# Altium project HW_Dron_V2.PrjPcb
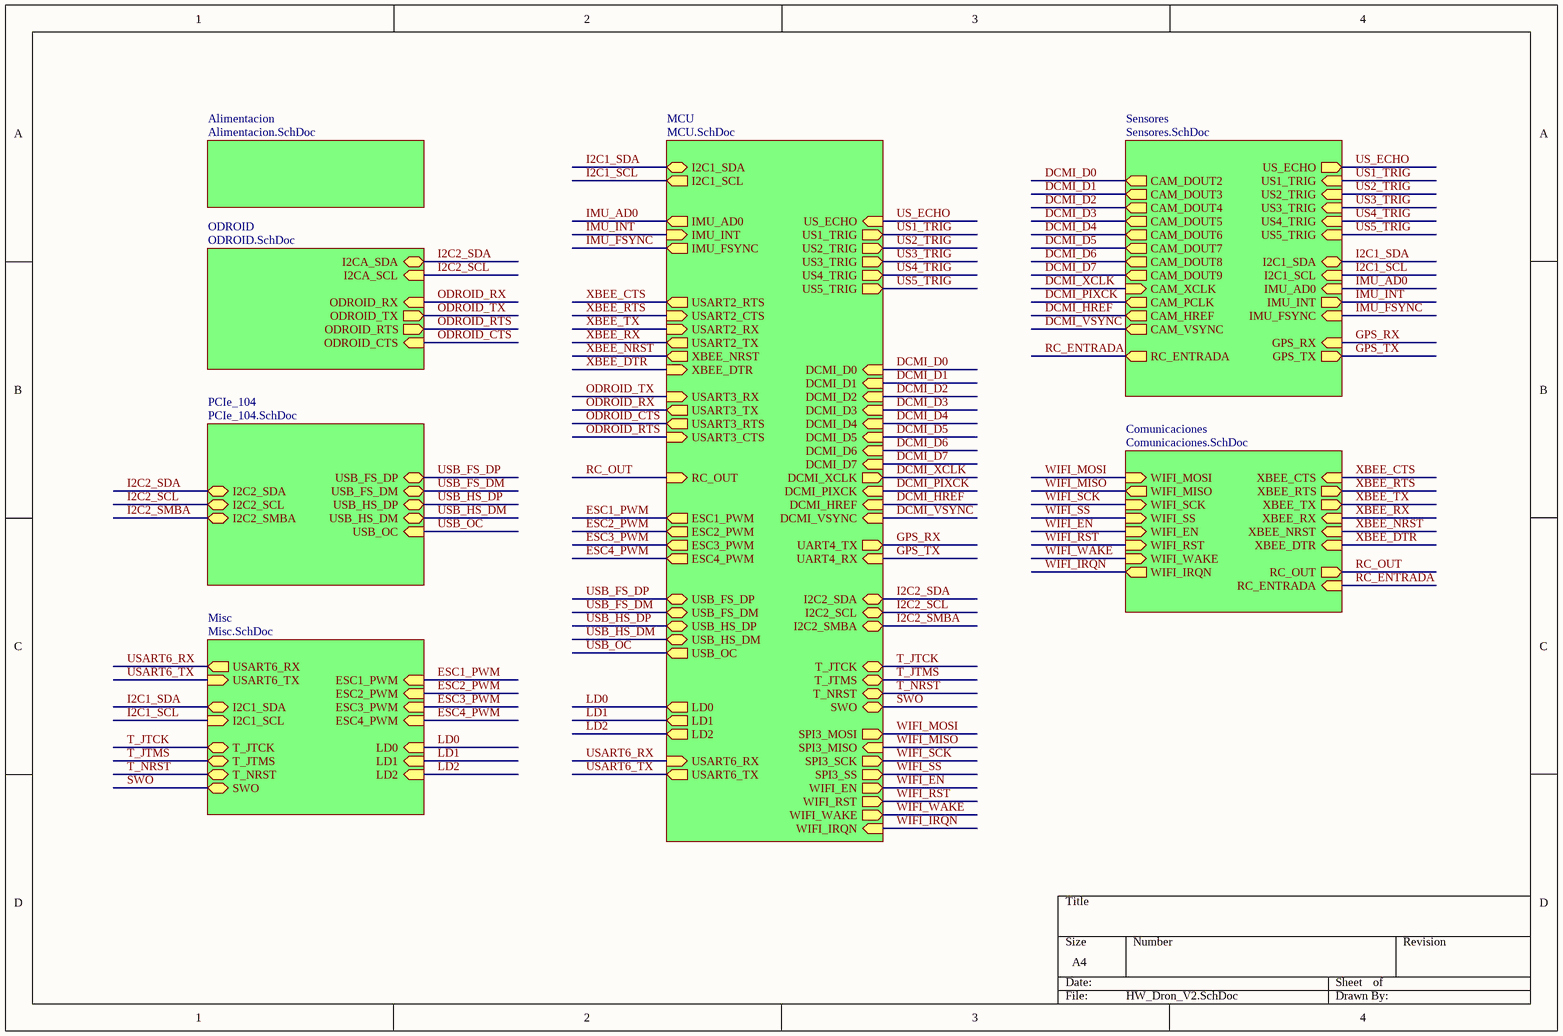
[diagram p0: HW_Dron_V2.SchDoc]
8 sheets, 111 parts. Net scope: hierarchical (ports join the sheet entries above them; power ports are global).
Board file: HW_Dron_V2.PcbDoc
Sheets:
  HW_Dron_V2.SchDoc
    MCU = MCU.SchDoc
    Sensores = Sensores.SchDoc
    Alimentacion = Alimentacion.SchDoc
    Comunicaciones = Comunicaciones.SchDoc
    ODROID = ODROID.SchDoc
    PCIe_104 = PCIe_104.SchDoc
    Misc = Misc.SchDoc

## Sheet HW_Dron_V2.SchDoc
size A4

### Sub-sheets
Alimentacion = Alimentacion.SchDoc: no entries
Comunicaciones = Comunicaciones.SchDoc: XBEE_TX (out), XBEE_RX (in), XBEE_NRST (in), XBEE_CTS (in), XBEE_RTS (out), RC_OUT (out), WIFI_MOSI (in), WIFI_MISO (out), WIFI_SCK (in), WIFI_SS (in), WIFI_EN (in), WIFI_RST (in), WIFI_WAKE (in), WIFI_IRQN (out), XBEE_DTR (in), RC_ENTRADA (in)
MCU = MCU.SchDoc: I2C1_SDA (bidir), I2C1_SCL (out), IMU_AD0 (out), IMU_INT (in), US_ECHO (in), US1_TRIG (out), US2_TRIG (out), US3_TRIG (out), US4_TRIG (out), US5_TRIG (out), DCMI_D0 (in), DCMI_D1 (in), DCMI_D2 (in), DCMI_D3 (in), DCMI_D4 (in), DCMI_D5 (in), DCMI_D6 (in), DCMI_D7 (in), DCMI_PIXCK (in), DCMI_HREF (in), DCMI_VSYNC (in), DCMI_XCLK (out), USART2_RX (in), USART2_TX (out), XBEE_NRST (out), USART2_RTS (out), USART2_CTS (in), RC_OUT (in), UART4_TX (out), UART4_RX (in), ESC1_PWM (out), ESC2_PWM (out), ESC3_PWM (out), ESC4_PWM (out), I2C2_SDA (bidir), I2C2_SCL (bidir), I2C2_SMBA (bidir), USB_HS_DP (bidir), USB_HS_DM (bidir), USB_OC (out), T_JTCK, T_JTMS, T_NRST, LD0 (out), LD1 (out), LD2 (out), SPI3_MOSI (out), SPI3_MISO (in), SPI3_SCK (out), SPI3_SS (out), WIFI_EN (out), WIFI_RST (out), WIFI_WAKE (out), WIFI_IRQN (in), USB_FS_DP (bidir), USB_FS_DM (bidir), USART6_RX (in), USART6_TX (out), IMU_FSYNC (out), XBEE_DTR (in), USART3_TX (out), USART3_RX (in), USART3_CTS (in), USART3_RTS (out), SWO
Misc = Misc.SchDoc: ESC1_PWM (in), ESC2_PWM (in), ESC3_PWM (in), ESC4_PWM (in), USART6_RX (out), USART6_TX (in), I2C1_SDA (bidir), I2C1_SCL (in), LD0 (in), LD1 (in), LD2 (in), T_JTCK, T_JTMS, T_NRST, SWO
ODROID = ODROID.SchDoc: ODROID_RX (in), ODROID_TX (out), ODROID_RTS (out), ODROID_CTS (in), I2CA_SDA (bidir), I2CA_SCL (in)
PCIe_104 = PCIe_104.SchDoc: USB_HS_DP (bidir), USB_HS_DM (bidir), USB_OC (in), USB_FS_DP (bidir), USB_FS_DM (bidir), I2C2_SDA (bidir), I2C2_SCL (bidir), I2C2_SMBA (bidir)
Sensores = Sensores.SchDoc: I2C1_SCL (in), I2C1_SDA (bidir), IMU_AD0 (in), IMU_INT (out), US_ECHO (out), US1_TRIG (in), US2_TRIG (in), US3_TRIG (in), US4_TRIG (in), US5_TRIG (in), GPS_RX (in), GPS_TX (out), CAM_PCLK (out), CAM_HREF (out), CAM_VSYNC (out), CAM_XCLK (in), CAM_DOUT2 (out), CAM_DOUT3 (out), CAM_DOUT4 (out), CAM_DOUT5 (out), CAM_DOUT6 (out), CAM_DOUT7 (out), CAM_DOUT8 (out), CAM_DOUT9 (out), IMU_FSYNC (in), RC_ENTRADA (out)

### Nets
DCMI_D0: sheet MCU/DCMI_D0, sheet Sensores/CAM_DOUT2
DCMI_D1: sheet MCU/DCMI_D1, sheet Sensores/CAM_DOUT3
DCMI_D2: sheet MCU/DCMI_D2, sheet Sensores/CAM_DOUT4
DCMI_D3: sheet MCU/DCMI_D3, sheet Sensores/CAM_DOUT5
DCMI_D4: sheet MCU/DCMI_D4, sheet Sensores/CAM_DOUT6
DCMI_D5: sheet MCU/DCMI_D5, sheet Sensores/CAM_DOUT7
DCMI_D6: sheet MCU/DCMI_D6, sheet Sensores/CAM_DOUT8
DCMI_D7: sheet MCU/DCMI_D7, sheet Sensores/CAM_DOUT9
DCMI_HREF: sheet MCU/DCMI_HREF, sheet Sensores/CAM_HREF
DCMI_PIXCK: sheet MCU/DCMI_PIXCK, sheet Sensores/CAM_PCLK
DCMI_VSYNC: sheet MCU/DCMI_VSYNC, sheet Sensores/CAM_VSYNC
DCMI_XCLK: sheet MCU/DCMI_XCLK, sheet Sensores/CAM_XCLK
ESC1_PWM: sheet MCU/ESC1_PWM, sheet Misc/ESC1_PWM
ESC2_PWM: sheet MCU/ESC2_PWM, sheet Misc/ESC2_PWM
ESC3_PWM: sheet MCU/ESC3_PWM, sheet Misc/ESC3_PWM
ESC4_PWM: sheet MCU/ESC4_PWM, sheet Misc/ESC4_PWM
GPS_RX: sheet MCU/UART4_TX, sheet Sensores/GPS_RX
GPS_TX: sheet MCU/UART4_RX, sheet Sensores/GPS_TX
I2C1_SCL: sheet MCU/I2C1_SCL, sheet Sensores/I2C1_SCL, sheet Misc/I2C1_SCL
I2C1_SDA: sheet MCU/I2C1_SDA, sheet Sensores/I2C1_SDA, sheet Misc/I2C1_SDA
I2C2_SCL: sheet MCU/I2C2_SCL, sheet ODROID/I2CA_SCL, sheet PCIe_104/I2C2_SCL
I2C2_SDA: sheet MCU/I2C2_SDA, sheet ODROID/I2CA_SDA, sheet PCIe_104/I2C2_SDA
I2C2_SMBA: sheet MCU/I2C2_SMBA, sheet PCIe_104/I2C2_SMBA
IMU_AD0: sheet MCU/IMU_AD0, sheet Sensores/IMU_AD0
IMU_FSYNC: sheet MCU/IMU_FSYNC, sheet Sensores/IMU_FSYNC
IMU_INT: sheet MCU/IMU_INT, sheet Sensores/IMU_INT
LD0: sheet MCU/LD0, sheet Misc/LD0
LD1: sheet MCU/LD1, sheet Misc/LD1
LD2: sheet MCU/LD2, sheet Misc/LD2
ODROID_CTS: sheet MCU/USART3_RTS, sheet ODROID/ODROID_CTS
ODROID_RTS: sheet MCU/USART3_CTS, sheet ODROID/ODROID_RTS
ODROID_RX: sheet MCU/USART3_TX, sheet ODROID/ODROID_RX
ODROID_TX: sheet MCU/USART3_RX, sheet ODROID/ODROID_TX
RC_ENTRADA: sheet Sensores/RC_ENTRADA, sheet Comunicaciones/RC_ENTRADA
RC_OUT: sheet MCU/RC_OUT, sheet Comunicaciones/RC_OUT
SWO: sheet MCU/SWO, sheet Misc/SWO
T_JTCK: sheet MCU/T_JTCK, sheet Misc/T_JTCK
T_JTMS: sheet MCU/T_JTMS, sheet Misc/T_JTMS
T_NRST: sheet MCU/T_NRST, sheet Misc/T_NRST
US1_TRIG: sheet MCU/US1_TRIG, sheet Sensores/US1_TRIG
US2_TRIG: sheet MCU/US2_TRIG, sheet Sensores/US2_TRIG
US3_TRIG: sheet MCU/US3_TRIG, sheet Sensores/US3_TRIG
US4_TRIG: sheet MCU/US4_TRIG, sheet Sensores/US4_TRIG
US5_TRIG: sheet MCU/US5_TRIG, sheet Sensores/US5_TRIG
US_ECHO: sheet MCU/US_ECHO, sheet Sensores/US_ECHO
USART6_RX: sheet MCU/USART6_RX, sheet Misc/USART6_RX
USART6_TX: sheet MCU/USART6_TX, sheet Misc/USART6_TX
USB_FS_DM: sheet MCU/USB_FS_DM, sheet PCIe_104/USB_FS_DM  [project net USB0_N]
USB_FS_DP: sheet MCU/USB_FS_DP, sheet PCIe_104/USB_FS_DP  [project net USB0_P]
USB_HS_DM: sheet MCU/USB_HS_DM, sheet PCIe_104/USB_HS_DM  [project net USB1_N]
USB_HS_DP: sheet MCU/USB_HS_DP, sheet PCIe_104/USB_HS_DP  [project net USB1_P]
USB_OC: sheet MCU/USB_OC, sheet PCIe_104/USB_OC
WIFI_EN: sheet MCU/WIFI_EN, sheet Comunicaciones/WIFI_EN
WIFI_IRQN: sheet MCU/WIFI_IRQN, sheet Comunicaciones/WIFI_IRQN
WIFI_MISO: sheet MCU/SPI3_MISO, sheet Comunicaciones/WIFI_MISO
WIFI_MOSI: sheet MCU/SPI3_MOSI, sheet Comunicaciones/WIFI_MOSI
WIFI_RST: sheet MCU/WIFI_RST, sheet Comunicaciones/WIFI_RST
WIFI_SCK: sheet MCU/SPI3_SCK, sheet Comunicaciones/WIFI_SCK
WIFI_SS: sheet MCU/SPI3_SS, sheet Comunicaciones/WIFI_SS
WIFI_WAKE: sheet MCU/WIFI_WAKE, sheet Comunicaciones/WIFI_WAKE
XBEE_CTS: sheet MCU/USART2_RTS, sheet Comunicaciones/XBEE_CTS
XBEE_DTR: sheet MCU/XBEE_DTR, sheet Comunicaciones/XBEE_DTR
XBEE_NRST: sheet MCU/XBEE_NRST, sheet Comunicaciones/XBEE_NRST
XBEE_RTS: sheet MCU/USART2_CTS, sheet Comunicaciones/XBEE_RTS
XBEE_RX: sheet MCU/USART2_TX, sheet Comunicaciones/XBEE_RX
XBEE_TX: sheet MCU/USART2_RX, sheet Comunicaciones/XBEE_TX

## Sheet MCU.SchDoc
size A4
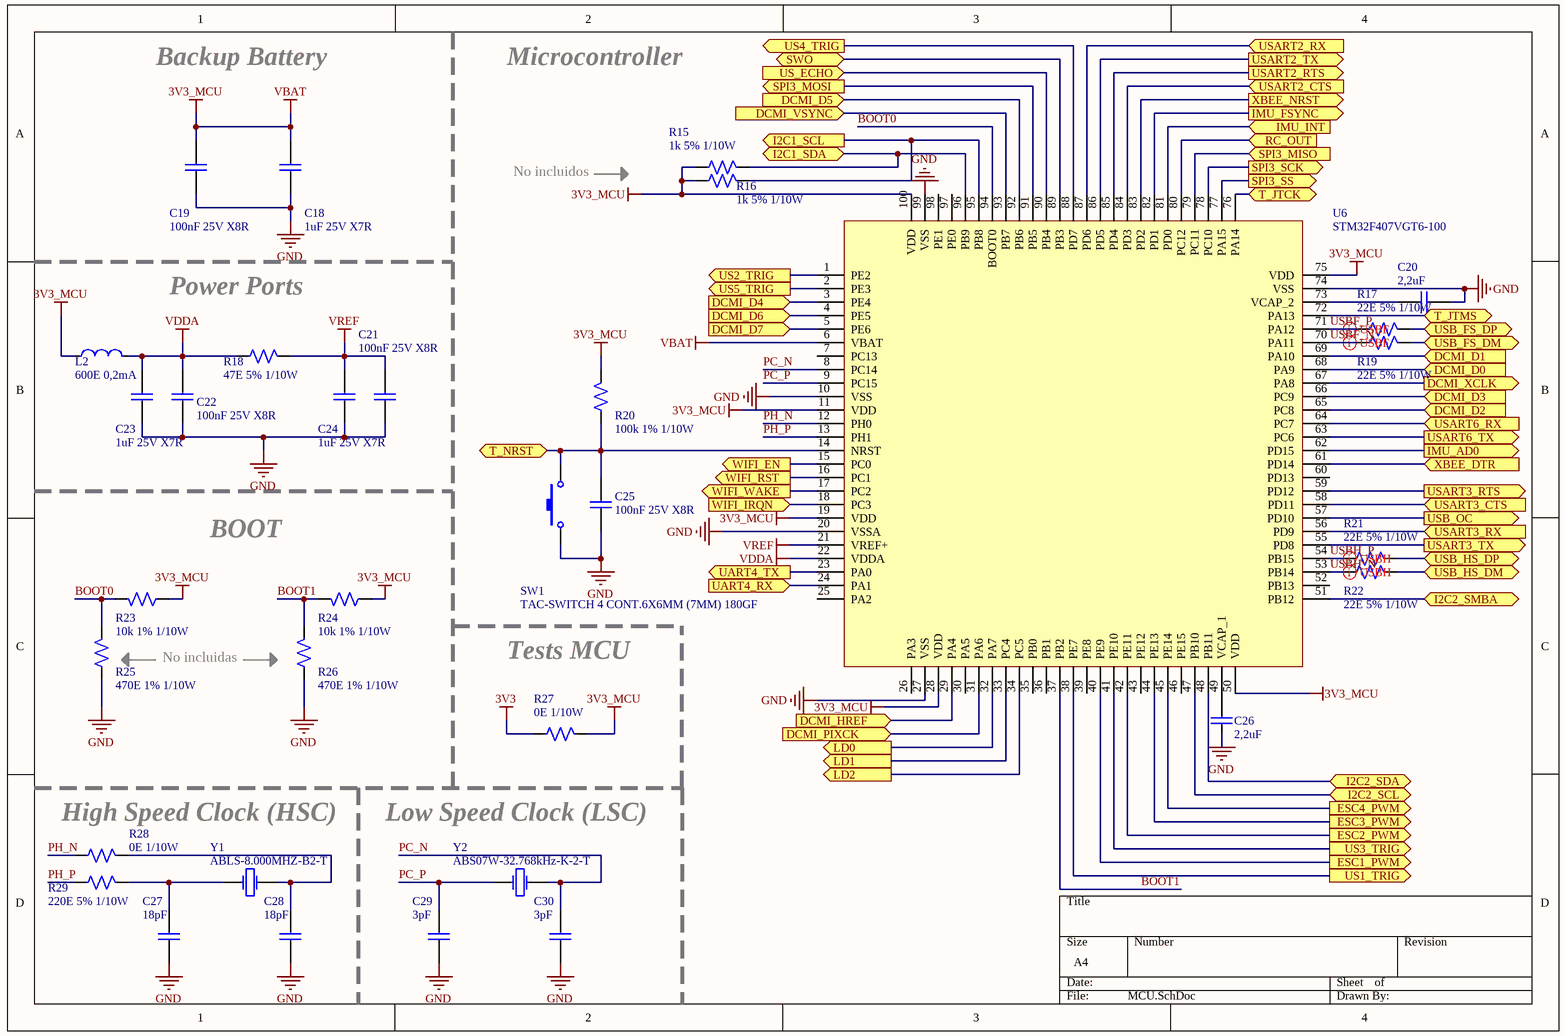
[diagram p1: MCU.SchDoc]

### Parts
C18  1uF 25V X7R  [C0603]
C19  100nF 25V X8R  [C0603]
C20  Valor: 2,2uF  [C0603]  (hidden comment: 2,2uF 16V X7R)
C21  100nF 25V X8R  [C0603]
C22  100nF 25V X8R  [C0603]
C23  1uF 25V X7R  [C0603]
C24  1uF 25V X7R  [C0603]
C25  100nF 25V X8R  [C0603]
C26  Valor: 2,2uF  [C0603]  (hidden comment: 2,2uF 16V X7R)
C27  Valor: 18pF  [C0603]  (hidden comment: 18pF 50V COG 5%)
C28  Valor: 18pF  [C0603]  (hidden comment: 18pF 50V COG 5%)
C29  Valor: 3pF  [C0603]  (hidden comment: 3pF 50V COG 5%)
C30  Valor: 3pF  [C0603]  (hidden comment: 3pF 50V COG 5%)
L2  600E 0,2mA  [L0805]
R15  1k 5% 1/10W  [R0603]
R16  1k 5% 1/10W  [R0603]
R17  22E 5% 1/10W  [R0603]
R18  47E 5% 1/10W  [R0603]
R19  22E 5% 1/10W  [R0603]
R20  100k 1% 1/10W  [R0603]
R21  22E 5% 1/10W  [R0603]
R22  22E 5% 1/10W  [R0603]
R23  10k 1% 1/10W  [R0603]
R24  10k 1% 1/10W  [R0603]
R25  470E 1% 1/10W  [R0603]
R26  470E 1% 1/10W  [R0603]
R27  0E 1/10W  [R0805]
R28  0E 1/10W  [R0603]
R29  220E 5% 1/10W  [R0603]
SW1  TAC-SWITCH 4 CONT.6X6MM (7MM) 180GF  [TAC_SW_4]
U6  STM32F407VGT6-100  [QFP100]
Y1  ABLS-8.000MHZ-B2-T  [ABLS]
Y2  ABS07W-32.768kHz-K-2-T  [ABS07W]

### Ports
DCMI_D0 (in), DCMI_D1 (in), DCMI_D2 (in), DCMI_D3 (in), DCMI_D4 (in), DCMI_D5 (in), DCMI_D6 (in), DCMI_D7 (in), DCMI_HREF (in), DCMI_PIXCK (in), DCMI_VSYNC (in), DCMI_XCLK (out), ESC1_PWM (out), ESC2_PWM (out), ESC3_PWM (out), ESC4_PWM (out), I2C1_SCL (out), I2C1_SDA (bidir), I2C2_SCL (bidir), I2C2_SDA (bidir), I2C2_SMBA (bidir), IMU_AD0 (out), IMU_FSYNC (out), IMU_INT (in), LD0 (out), LD1 (out), LD2 (out), RC_OUT (in), SPI3_MISO (in), SPI3_MOSI (out), SPI3_SCK (out), SPI3_SS (out), SWO, T_JTCK, T_JTMS, T_NRST, UART4_RX (in), UART4_TX (out), US1_TRIG (out), US2_TRIG (out), US3_TRIG (out), US4_TRIG (out), US5_TRIG (out), US_ECHO (in), USART2_CTS (in), USART2_RTS (out), USART2_RX (in), USART2_TX (out), USART3_CTS (in), USART3_RTS (out), USART3_RX (in), USART3_TX (out), USART6_RX (in), USART6_TX (out), USB_FS_DM (bidir), USB_FS_DP (bidir), USB_HS_DM (bidir), USB_HS_DP (bidir), USB_OC (out), WIFI_EN (out), WIFI_IRQN (in), WIFI_RST (out), WIFI_WAKE (out), XBEE_DTR (in), XBEE_NRST (out)

### Nets
3V3: R27.1
3V3_MCU: C18.1 C19.1 L2.1 R15.1 R16.1 R20.2 R23.1 R24.1 R27.2 U6.6(VBAT) U6.11(VDD) U6.19(VDD) U6.28(VDD) U6.50(VDD) U6.75(VDD) U6.100(VDD)  [also labelled VBAT]
GND: C18.2 C19.2 C20.2 C21.2 C22.2 C23.2 C24.2 C25.2 C26.2 C27.2 C28.2 C29.2 C30.2 R25.1 R26.1 SW1.1 U6.10(VSS) U6.20(VSSA) U6.27(VSS) U6.74(VSS) U6.99(VSS)
VDDA: C22.1 C23.1 L2.2 R18.1 U6.22(VDDA)
VREF: C21.1 C24.1 R18.2 U6.21(VREF+)
BOOT0: R23.2 R25.2 U6.94(BOOT0)
BOOT1: R24.2 R26.2 U6.37(PB2)
DCMI_D0: U6.68(PA9) ; port DCMI_D0
DCMI_D1: U6.69(PA10) ; port DCMI_D1
DCMI_D2: U6.65(PC8) ; port DCMI_D2
DCMI_D3: U6.66(PC9) ; port DCMI_D3
DCMI_D4: U6.3(PE4) ; port DCMI_D4
DCMI_D5: U6.92(PB6) ; port DCMI_D5
DCMI_D6: U6.4(PE5) ; port DCMI_D6
DCMI_D7: U6.5(PE6) ; port DCMI_D7
DCMI_HREF: U6.29(PA4) ; port DCMI_HREF
DCMI_PIXCK: U6.31(PA6) ; port DCMI_PIXCK
DCMI_VSYNC: U6.93(PB7) ; port DCMI_VSYNC
DCMI_XCLK: U6.67(PA8) ; port DCMI_XCLK
ESC1_PWM: U6.40(PE9) ; port ESC1_PWM
ESC2_PWM: U6.42(PE11) ; port ESC2_PWM
ESC3_PWM: U6.44(PE13) ; port ESC3_PWM
ESC4_PWM: U6.45(PE14) ; port ESC4_PWM
GPS_RX: U6.23(PA0) ; port UART4_TX
GPS_TX: U6.24(PA1) ; port UART4_RX
I2C1_SCL: R16.2 U6.95(PB8) ; port I2C1_SCL
I2C1_SDA: R15.2 U6.96(PB9) ; port I2C1_SDA
I2C2_SCL: U6.47(PB10) ; port I2C2_SCL
I2C2_SDA: U6.48(PB11) ; port I2C2_SDA
I2C2_SMBA: U6.51(PB12) ; port I2C2_SMBA
IMU_AD0: U6.62(PD15) ; port IMU_AD0
IMU_FSYNC: U6.82(PD1) ; port IMU_FSYNC
IMU_INT: U6.81(PD0) ; port IMU_INT
LD0: U6.32(PA7) ; port LD0
LD1: U6.33(PC4) ; port LD1
LD2: U6.34(PC5) ; port LD2
ODROID_CTS: U6.59(PD12) ; port USART3_RTS
ODROID_RTS: U6.58(PD11) ; port USART3_CTS
ODROID_RX: U6.55(PD8) ; port USART3_TX
ODROID_TX: U6.56(PD9) ; port USART3_RX
PC_N: C30.1 U6.8(PC14) Y2.2
PC_P: C29.1 U6.9(PC15) Y2.1
PH_N: R28.1 U6.12(PH0)
PH_P: R29.1 U6.13(PH1)
RC_OUT: U6.80(PC12) ; port RC_OUT
SWO: U6.89(PB3) ; port SWO
T_JTCK: U6.76(PA14) ; port T_JTCK
T_JTMS: U6.72(PA13) ; port T_JTMS
T_NRST: C25.1 R20.1 SW1.2 U6.14(NRST) ; port T_NRST
US1_TRIG: U6.38(PE7) ; port US1_TRIG
US2_TRIG: U6.1(PE2) ; port US2_TRIG
US3_TRIG: U6.41(PE10) ; port US3_TRIG
US4_TRIG: U6.88(PD7) ; port US4_TRIG
US5_TRIG: U6.2(PE3) ; port US5_TRIG
US_ECHO: U6.90(PB4) ; port US_ECHO
USART6_RX: U6.64(PC7) ; port USART6_RX
USART6_TX: U6.63(PC6) ; port USART6_TX
USB0_N: R19.2 ; port USB_FS_DM
USB0_P: R17.2 ; port USB_FS_DP
USB1_N: R22.2 ; port USB_HS_DM
USB1_P: R21.2 ; port USB_HS_DP
USB_OC: U6.57(PD10) ; port USB_OC
USBF_N: R19.1 U6.70(PA11)
USBF_P: R17.1 U6.71(PA12)
USBH_N: R22.1 U6.53(PB14)
USBH_P: R21.1 U6.54(PB15)
WIFI_EN: U6.15(PC0) ; port WIFI_EN
WIFI_IRQN: U6.18(PC3) ; port WIFI_IRQN
WIFI_MISO: U6.79(PC11) ; port SPI3_MISO
WIFI_MOSI: U6.91(PB5) ; port SPI3_MOSI
WIFI_RST: U6.16(PC1) ; port WIFI_RST
WIFI_SCK: U6.78(PC10) ; port SPI3_SCK
WIFI_SS: U6.77(PA15) ; port SPI3_SS
WIFI_WAKE: U6.17(PC2) ; port WIFI_WAKE
XBEE_CTS: U6.85(PD4) ; port USART2_RTS
XBEE_DTR: U6.61(PD14) ; port XBEE_DTR
XBEE_NRST: U6.83(PD2) ; port XBEE_NRST
XBEE_RTS: U6.84(PD3) ; port USART2_CTS
XBEE_RX: U6.86(PD5) ; port USART2_TX
XBEE_TX: U6.87(PD6) ; port USART2_RX
NetC20_1: C20.1 U6.73(VCAP_2)
NetC26_1: C26.1 U6.49(VCAP_1)
NetC27_1: C27.1 R29.2 Y1.1
NetC28_1: C28.1 R28.2 Y1.2

Not connected (* = marked no-connect by the designer): U6 7(PC13) 25(PA2) 26(PA3) 30(PA5) 35(PB0) 36(PB1) 39(PE8) 43(PE12) 46(PE15) 52(PB13) 60(PD13) 97(PE0) 98(PE1)

### Layout directives
differential pair: USBF_N, USBF_P, USBH_N, USBH_P

### Notes on the sheet
- Backup Battery
- Microcontroller
- No incluidos
- Power Ports
- BOOT
- No incluidas
- Tests MCU
- (near R28) High Speed Clock (HSC)
- Low Speed Clock (LSC)

### Library data of the parts
C18 C23 C24 = Capacitor: Capacitor de placas paralelas; Proveedor: Mouser; Cod. Proveedor: 810-C1608X7R1E105KAE; Encapsulado: C0603; Valor: 1uF; Link: https://ar.mouser.com
C19 C21 C22 C25 = Capacitor: Capacitor de placas paralelas; Proveedor: Mouser; Cod. Proveedor: 810-C1608X8R1E104K; Encapsulado: C0603; Valor: 100nF; Link: https://ar.mouser.com
C20 C26 = Capacitor: Capacitor de placas paralelas; Proveedor: Mouser; Cod. Proveedor: 80-C0805C225K4R3123; Encapsulado: C0603; Link: https://ar.mouser.com/
C27-C30 = Capacitor: Capacitor de placas paralelas; Proveedor: Elemon; Cod. Proveedor: CA3278360; Encapsulado: C0603; Link: http://www.elemon.net/
L2 = Inductor: Cod. Proveedor: FI1488955; Proveedor: Elemon; Encapsulado: L0805; Valor: 600E 0,2mA; Link: http://www.elemon.net/
R15 R16 = Resistor: Resistencia; Cod. Proveedor: 603-AF0603JR-071KL; Proveedor: Mouser; Encapsulado: R0603; Valor: 1k; Link: https://ar.mouser.com
R17 R19 R21 R22 = Resistor: Resistencia; Cod. Proveedor: 71-CRCW060322R0JNEAC; Proveedor: Mouser; Encapsulado: R0603; Valor: 22E; Link: https://ar.mouser.com
R18 = Resistor: Resistencia; Cod. Proveedor: 667-ERJ-3GEYJ470V; Proveedor: Mouser; Encapsulado: R0603; Valor: 47E; Link: https://ar.mouser.com
R20 = Resistor: Resistencia; Cod. Proveedor: 71-CRCW0603100KFKEAC; Proveedor: Mouser; Encapsulado: R0603; Valor: 100k; Link: https://ar.mouser.com
R23 R24 = Resistor: Resistencia; Cod. Proveedor: 71-CRCW060310K0FKEAC; Proveedor: Mouser; Encapsulado: R0603; Valor: 10k; Link: https://ar.mouser.com
R25 R26 = Resistor: Resistencia; Cod. Proveedor: 603-RC0603FR-10470RL; Proveedor: Mouser; Encapsulado: R0603; Valor: 470E; Link: https://ar.mouser.com
R27 = Resistor: Resistencia; Cod. Proveedor: RS3895900; Proveedor: Mouser; Encapsulado: MODIFICAR; Valor: 0E; Link: https://ar.mouser.com
R28 = Resistor: Resistencia; Cod. Proveedor: RS3895900; Proveedor: Mouser; Encapsulado: R0603; Valor: 0E; Link: https://ar.mouser.com
R29 = Resistor: Resistencia; Cod. Proveedor: 71-CRCW0603220RJNEAC; Proveedor: Mouser; Encapsulado: R0603; Valor: 220E; Link: https://ar.mouser.com
SW1 = TAC_SWITCH_4: Pulsador de 4 pines; Proveedor: Elemon; Cod. Proveedor: MC5702109; Encapsulado: Through Hole; Link: http://www.elemon.net
U6 = STM32F407VGT6_100: Microcontrolador STM32F407VGT6 100 pines; Cod. Proveedor: 511-STM32F407VGT6; Proveedor: Mouser; Encapsulado: QFP100; Link: https://ar.mouser.com/
Y1 = XTAL: Resonador cerámico; Cod. Proveedor: 815-ABLS-8-B2; Proveedor: Mouser; Encapsulado: SMD; Link: https://ar.mouser.com
Y2 = XTAL: Resonador cerámico; Cod. Proveedor: 815-ABS07W32.768KK2T; Proveedor: Mouser; Encapsulado: SMD; Link: https://ar.mouser.com

## Sheet Sensores.SchDoc
size A4
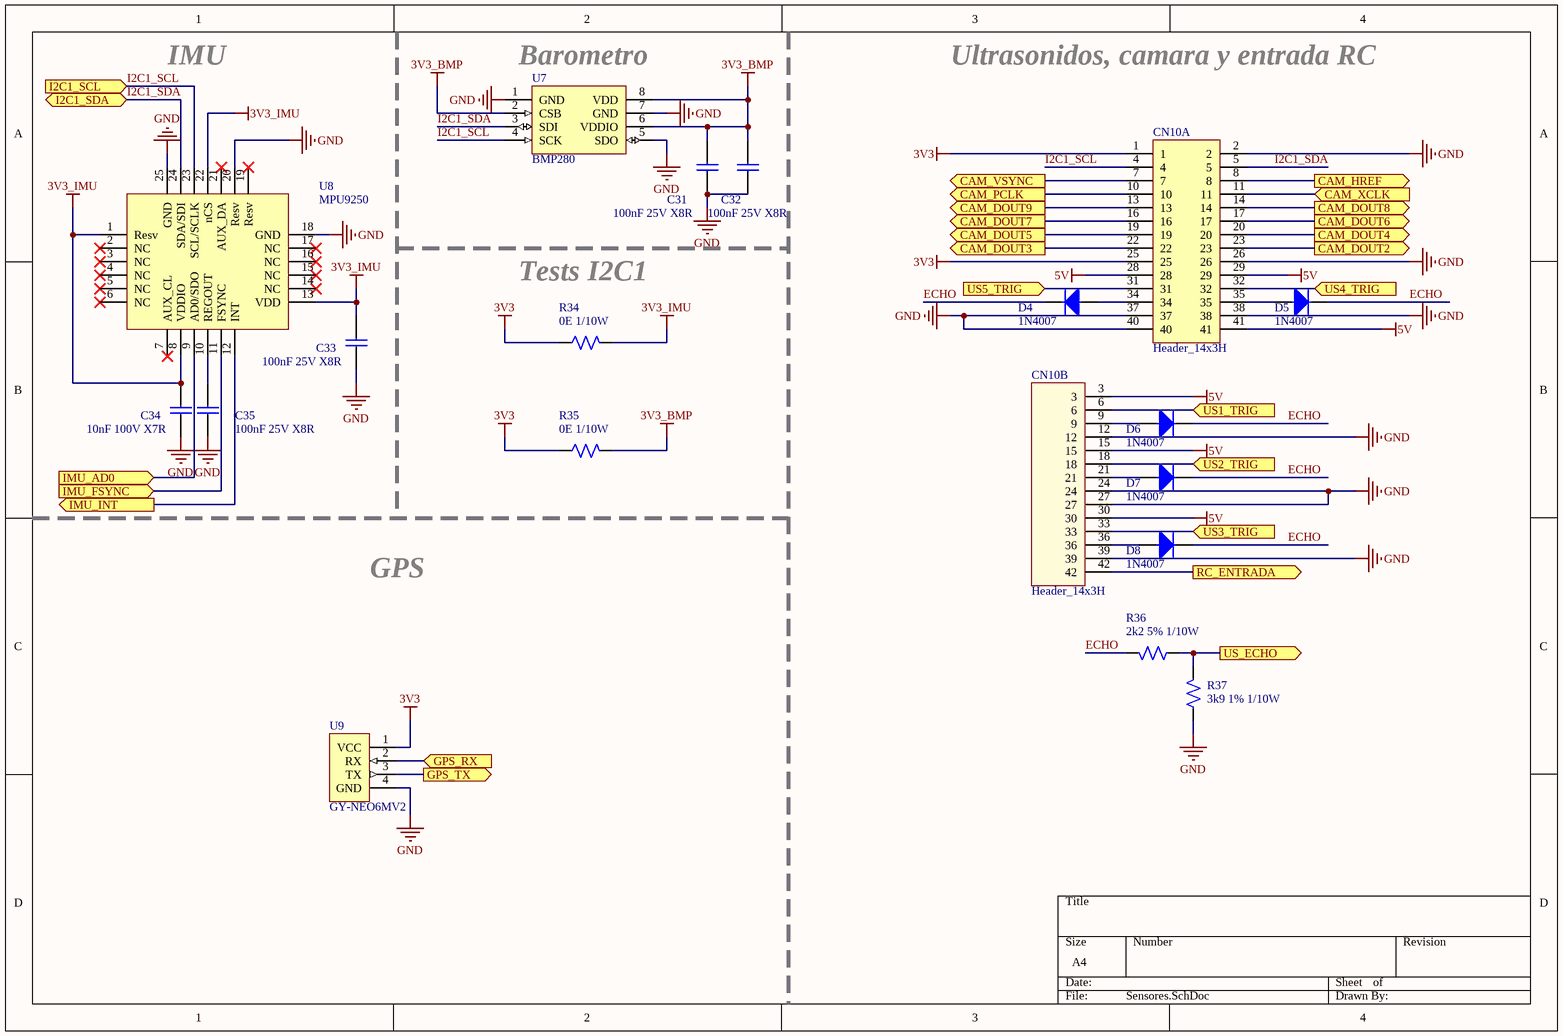
[diagram p2: Sensores.SchDoc]

### Parts
C31  100nF 25V X8R  [C0603]
C32  100nF 25V X8R  [C0603]
C33  100nF 25V X8R  [C0603]
C34  10nF 100V X7R  [C0603]
C35  100nF 25V X8R  [C0603]
CN10  Header_14x3H  [HEADER_14x3H]  (parts A,B of 2)
D4  1N4007  [SMA (DO-214AC)]
D5  1N4007  [SMA (DO-214AC)]
D6  1N4007  [SMA (DO-214AC)]
D7  1N4007  [SMA (DO-214AC)]
D8  1N4007  [SMA (DO-214AC)]
R34  0E 1/10W  [R0805]
R35  0E 1/10W  [R0805]
R36  2k2 5% 1/10W  [R0603]
R37  3k9 1% 1/10W  [R0603]
U7  BMP280  [BMP280]
U8  MPU9250  [MPU9250_HS]
U9  GY-NEO6MV2  [GY-NEO6MV2]

### Ports
CAM_DOUT2 (out), CAM_DOUT3 (out), CAM_DOUT4 (out), CAM_DOUT5 (out), CAM_DOUT6 (out), CAM_DOUT7 (out), CAM_DOUT8 (out), CAM_DOUT9 (out), CAM_HREF (out), CAM_PCLK (out), CAM_VSYNC (out), CAM_XCLK (in), GPS_RX (in), GPS_TX (out), I2C1_SCL (in), I2C1_SDA (bidir), IMU_AD0 (in), IMU_FSYNC (in), IMU_INT (out), RC_ENTRADA (out), US1_TRIG (in), US2_TRIG (in), US3_TRIG (in), US4_TRIG (in), US5_TRIG (in), US_ECHO (out)

### Nets
3V3: CN10.1 CN10.25 R34.1 R35.1 U9.1(VCC)
3V3_BMP: C31.1 C32.1 R35.2 U7.2(CSB) U7.6(VDDIO) U7.8(VDD)
3V3_IMU: C33.1 C34.1 R34.2 U8.1(Resv) U8.8(VDDIO) U8.13(VDD) U8.22(nCS)
5V: CN10.3 CN10.15 CN10.28 CN10.29 CN10.30 CN10.41  [project net VOUT_SWTCH]
GND: C31.2 C32.2 C33.2 C34.2 C35.2 CN10.2 CN10.12 CN10.24 CN10.26 CN10.27 CN10.37 CN10.38 CN10.39 CN10.40 R37.1 U7.1(GND) U7.5(SDO) U7.7(GND) U8.18(GND) U8.20(Resv) U8.25(GND) U9.4(GND)
DCMI_D0: CN10.23 ; port CAM_DOUT2
DCMI_D1: CN10.22 ; port CAM_DOUT3
DCMI_D2: CN10.20 ; port CAM_DOUT4
DCMI_D3: CN10.19 ; port CAM_DOUT5
DCMI_D4: CN10.17 ; port CAM_DOUT6
DCMI_D5: CN10.16 ; port CAM_DOUT7
DCMI_D6: CN10.14 ; port CAM_DOUT8
DCMI_D7: CN10.13 ; port CAM_DOUT9
DCMI_HREF: CN10.8 ; port CAM_HREF
DCMI_PIXCK: CN10.10 ; port CAM_PCLK
DCMI_VSYNC: CN10.7 ; port CAM_VSYNC
DCMI_XCLK: CN10.11 ; port CAM_XCLK
ECHO: D4.2 D5.2 D6.2 D7.2 D8.2 R36.2
GPS_RX: U9.2(RX) ; port GPS_RX
GPS_TX: U9.3(TX) ; port GPS_TX
I2C1_SCL: CN10.4 U7.4(SCK) U8.23(SCL/SCLK) ; port I2C1_SCL
I2C1_SDA: CN10.5 U7.3(SDI) U8.24(SDA/SDI) ; port I2C1_SDA
IMU_AD0: U8.9(AD0/SDO) ; port IMU_AD0
IMU_FSYNC: U8.11(FSYNC) ; port IMU_FSYNC
IMU_INT: U8.12(INT) ; port IMU_INT
RC_ENTRADA: CN10.42 ; port RC_ENTRADA
US1_TRIG: CN10.6 ; port US1_TRIG
US2_TRIG: CN10.18 ; port US2_TRIG
US3_TRIG: CN10.33 ; port US3_TRIG
US4_TRIG: CN10.32 ; port US4_TRIG
US5_TRIG: CN10.31 ; port US5_TRIG
US_ECHO: R36.1 R37.2 ; port US_ECHO
NetC35_1: C35.1 U8.10(REGOUT)
NetCN10_9: CN10.9 D6.1
NetCN10_21: CN10.21 D7.1
NetCN10_34: CN10.34 D4.1
NetCN10_35: CN10.35 D5.1
NetCN10_36: CN10.36 D8.1

Not connected (* = marked no-connect by the designer): U8 2(NC)* 3(NC)* 4(NC)* 5(NC)* 6(NC)* 7(AUX_CL)* 14(NC)* 15(NC)* 16(NC)* 17(NC)* 19(Resv)* 21(AUX_DA)*

### Notes on the sheet
- IMU
- (near U7) Barometro
- Ultrasonidos, camara y entrada RC
- Tests I2C1
- GPS

### Library data of the parts
C31-C33 C35 = Capacitor: as C19 on sheet MCU; Encapsulado: C0603; Valor: 100nF; Link: https://ar.mouser.com
C34 = Capacitor: Capacitor de placas paralelas; Proveedor: Mouser; Cod. Proveedor: 81-GCM188R72A103KA7D; Encapsulado: C0603; Valor: 10nF; Link: https://ar.mouser.com
CN10 = Header_14x3H: Header, 14x3-pin
D4-D8 = Diode: Diodo; Cod. Proveedor: DI1202221; Proveedor: Elemon; Encapsulado: SMA; Link: http://www.elemon.net/
R34 R35 = Resistor: as R27 on sheet MCU; Valor: 0E; Link: https://ar.mouser.com
R36 = Resistor: Resistencia; Cod. Proveedor: 71-CRCW06032K20JNEAC; Proveedor: Mouser; Encapsulado: R0603; Valor: 2k2; Link: https://ar.mouser.com
R37 = Resistor: Resistencia; Cod. Proveedor: 71-CRCW06033K90FKEAC; Proveedor: Mouser; Encapsulado: R0603; Valor: 3k9; Link: https://ar.mouser.com
U7 = BMP280: Sensor de presion digital; Proveedor: Digikey; Cod. Proveedor: 828-1064-1-ND; Encapsulado: 8-SMD; Link: https://www.digikey.com/
U8 = MPU9250: IMU 9DOF; Cod. Proveedor: 410-MPU-9250; Proveedor: Mouser; Encapsulado: QFN24; Link: https://ar.mouser.com/
U9 = GY-NEO6MV2: Modulo GPS NEO6 V2

## Sheet Alimentacion.SchDoc
size A4
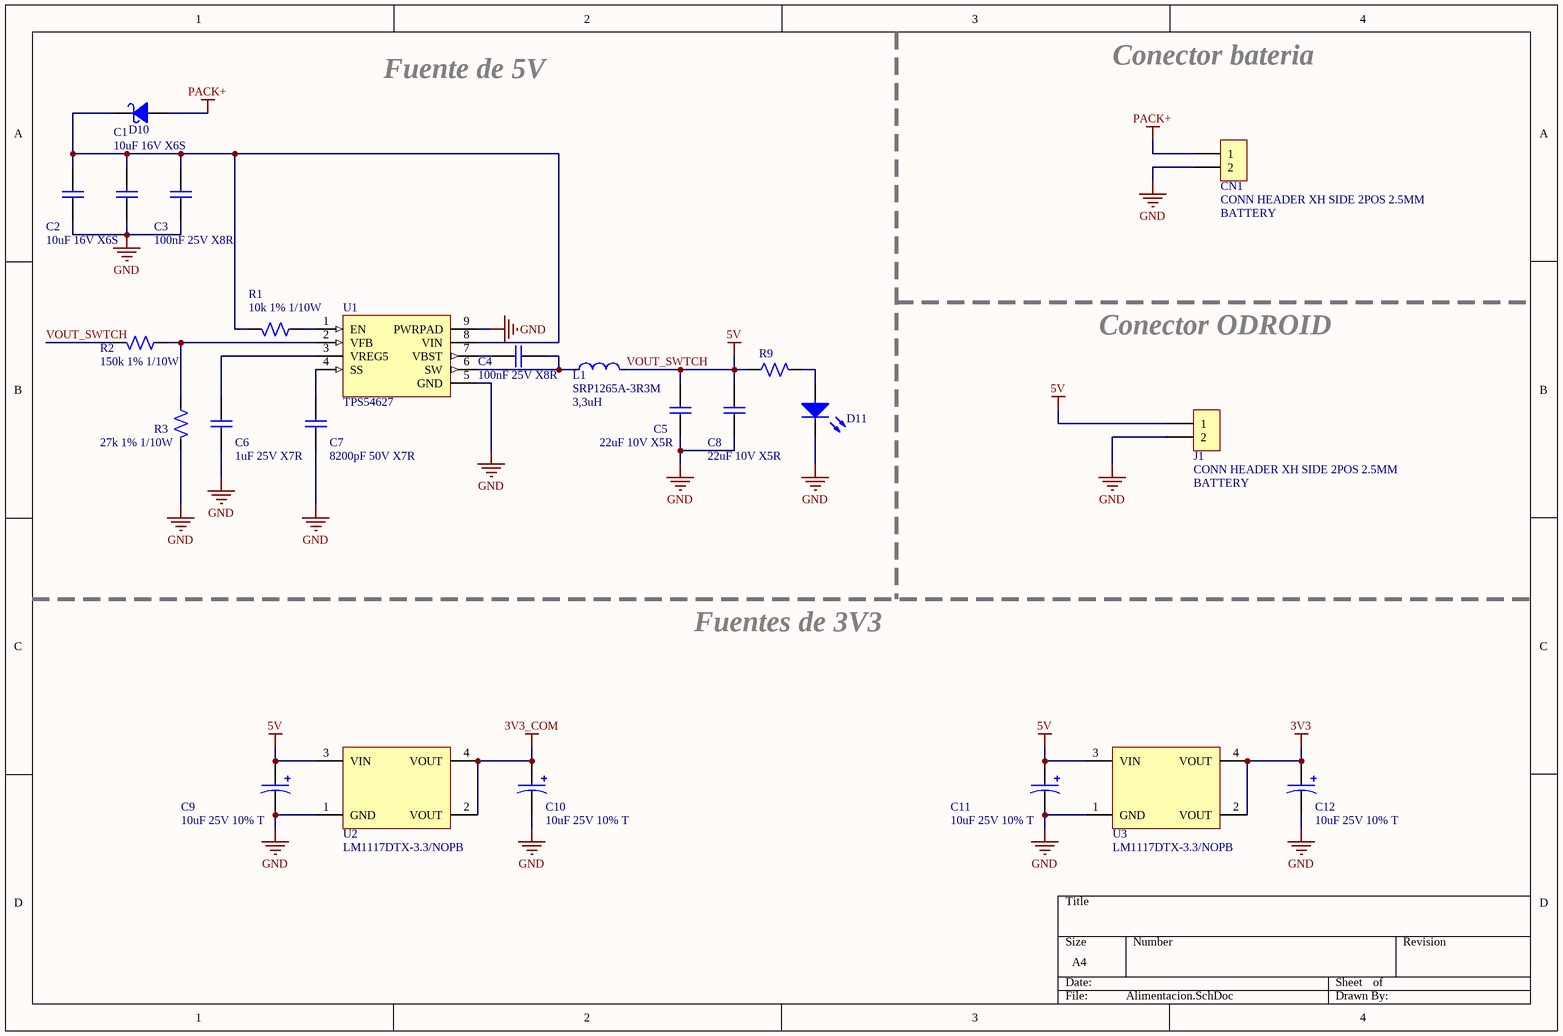
[diagram p3: Alimentacion.SchDoc]

### Parts
C1  10uF 16V X6S  [C1206]
C2  10uF 16V X6S  [C1206]
C3  100nF 25V X8R  [C1206]
C4  100nF 25V X8R  [C0603]
C5  22uF 10V X5R  [C1206]
C6  1uF 25V X7R  [C0603]
C7  8200pF 50V X7R  [C0603]
C8  22uF 10V X5R  [C1206]
C9  10uF 25V 10% T  [AVX_C]
C10  10uF 25V 10% T  [AVX_C]
C11  10uF 25V 10% T  [AVX_C]
C12  10uF 25V 10% T  [AVX_C]
CN1  CONN HEADER XH SIDE 2POS 2.5MM  [S2B-XH-A]
D10  Schottky  [SMC (DO-214AB)]  (value not drawn)
D11  Led  [LED_0805]  (value not drawn)
J1  CONN HEADER XH SIDE 2POS 2.5MM  [5V_OUT]
L1  SRP1265A-3R3M  Valor: 3,3uH  [SRP1265A]
R1  10k 1% 1/10W  [R0603]
R2  150k 1% 1/10W  [R0603]
R3  27k 1% 1/10W  [R0603]
R9  (no value)  [R0603]
U1  TPS54627  [HSOP-8]
U2  LM1117DTX-3.3/NOPB  [DPAK]
U3  LM1117DTX-3.3/NOPB  [DPAK]

### Nets
3V3: C12.1 U3.2(VOUT) U3.4(VOUT)
3V3_COM: C10.1 U2.2(VOUT) U2.4(VOUT)
GND: C1.2 C2.2 C3.2 C5.2 C6.2 C7.2 C8.2 C9.2 C10.2 C11.2 C12.2 CN1.2 D11.2 J1.2 R3.2 U1.5(GND) U1.9(PWRPAD) U2.1(GND) U3.1(GND)
PACK+: CN1.1 D10.1
VOUT_SWTCH: C5.1 C8.1 C9.1 C11.1 J1.1 L1.2 R2.2 R9.1 U2.3(VIN) U3.3(VIN)  [also labelled 5V]
NetC1_1: C1.1 C2.1 C3.1 D10.2 R1.2 U1.8(VIN)
NetC4_1: C4.1 U1.7(VBST)
NetC4_2: C4.2 L1.1 U1.6(SW)
NetC6_1: C6.1 U1.3(VREG5)
NetC7_1: C7.1 U1.4(SS)
NetD11_1: D11.1 R9.2
NetR1_1: R1.1 U1.1(EN)
NetR2_1: R2.1 R3.1 U1.2(VFB)

### Notes on the sheet
- Fuente de 5V
- Conector bateria
- Conector ODROID
- Fuentes de 3V3
- (in symbol Header_2) BATTERY

### Library data of the parts
C1 C2 = Capacitor: Capacitor de placas paralelas; Proveedor: Mouser; Cod. Proveedor: 81-GRM188C81C106MA3D; Encapsulado: MODIFICAR; Valor: 10uF; Link: https://ar.mouser.com/
C3 = Capacitor: Capacitor de placas paralelas; Proveedor: Mouser; Cod. Proveedor: 810-C1608X8R1E104K; Encapsulado: MODIFICAR; Valor: 100nF; Link: https://ar.mouser.com
C4 = Capacitor: as C19 on sheet MCU; Encapsulado: C0603; Valor: 100nF; Link: https://ar.mouser.com
C5 C8 = Capacitor: Capacitor de placas paralelas; Proveedor: Mouser; Cod. Proveedor: 81-ZRB18AR61A226ME1L; Encapsulado: MODIFICAR; Valor: 22uF; Link: https://ar.mouser.com/
C6 = Capacitor: as C18 on sheet MCU; Encapsulado: C0603; Valor: 1uF; Link: https://ar.mouser.com
C7 = Capacitor: Capacitor de placas paralelas; Proveedor: Mouser; Cod. Proveedor: 77-VJ0603Y822KXAPBC; Encapsulado: C0603; Valor: 8200pF; Link: https://ar.mouser.com
C9-C12 = CapaPol: Capacitor polarizado; Cod. Proveedor: 80-T491C106K25AT7280; Proveedor: Mouser; Encapsulado: AVX C Case; Valor: 10uF; Link: https://ar.mouser.com/
CN1 J1 = Header_2: Header, 2-pin; Cod. Proveedor: 455-2257-ND; Proveedor: Digikey; Encapsulado: Through Hole; Link: https://www.digikey.com
D10 = Schottky: Diodo Schottky
D11 = Led: Diodo Led
L1 = Inductor: Proveedor: Mouser; Encapsulado: SMD; Cod. Proveedor: 652-SRP1265A-3R3M; Link: https://ar.mouser.com
R1 = Resistor: as R23 on sheet MCU; Encapsulado: R0603; Valor: 10k; Link: https://ar.mouser.com
R2 = Resistor: Resistencia; Cod. Proveedor: 603-RC0603FR-07150KL; Proveedor: Mouser; Encapsulado: R0603; Valor: 150k; Link: https://ar.mouser.com
R3 = Resistor: Resistencia; Cod. Proveedor: 603-RC0603FR-1327KL; Proveedor: Mouser; Encapsulado: R0603; Valor: 27k; Link: http://www.elemon.net/
R9 = Resistor: Resistencia; Cod. Proveedor: 603-RC0603FR-10470RL; Proveedor: Mouser; Valor: 470E; Encapsulado: R0603; Link: https://ar.mouser.com
U1 = TPS54627: 4.5-V to 18-V Input, 6-A Synchronous Step-Down Converter; Proveedor: Mouser; Cod. Proveedor: 595-TPS54627DDAR; Encapsulado: HSOP-8; Link: https://ar.mouser.com
U2 U3 = LM1117: Low dropout oscilator; Cod. Proveedor: CI2707214D; Proveedor: Elemon; Encapsulado: TO-252-3; Link: http://www.elemon.net/

## Sheet Comunicaciones.SchDoc
size A4
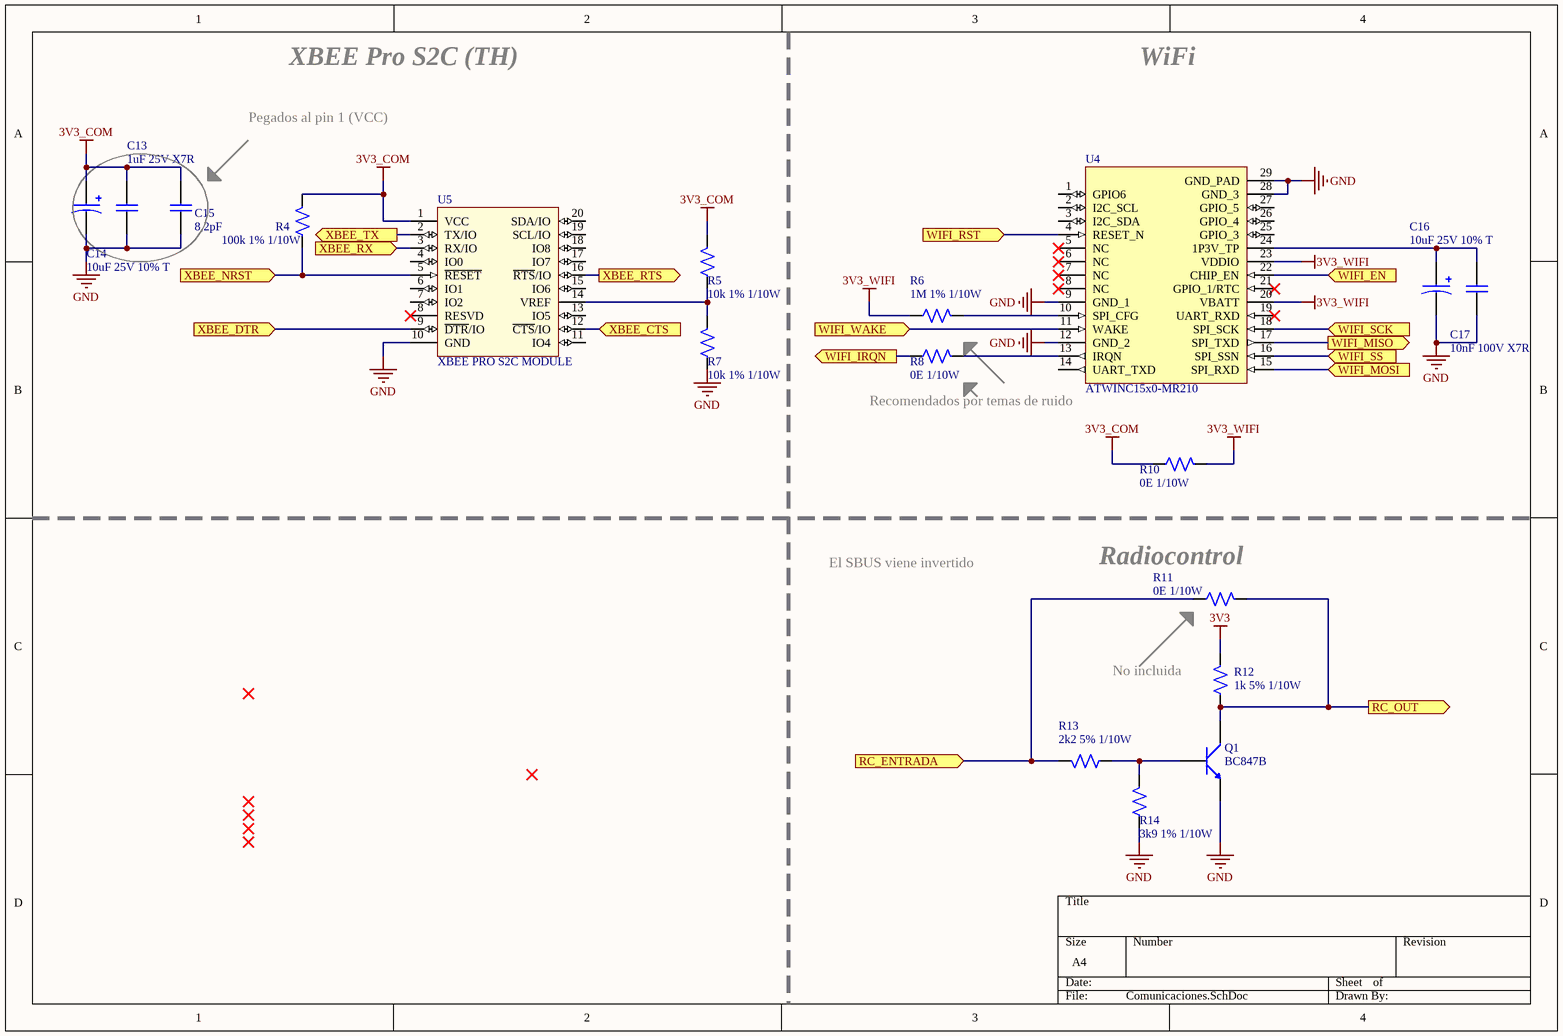
[diagram p4: Comunicaciones.SchDoc]

### Parts
C13  1uF 25V X7R  [C0603]
C14  10uF 25V 10% T  [AVX_C]
C15  Valor: 8,2pF  [C0603]  (hidden comment: 8,2pF 50V COG 5%)
C16  10uF 25V 10% T  [AVX_C]
C17  10nF 100V X7R  [C0603]
Q1  BC847B  [SOT23]
R4  100k 1% 1/10W  [R0603]
R5  10k 1% 1/10W  [R0603]
R6  1M 1% 1/10W  [R0603]
R7  10k 1% 1/10W  [R0603]
R8  0E 1/10W  [R0603]
R10  0E 1/10W  [R0805]
R11  0E 1/10W  [R0603]
R12  1k 5% 1/10W  [R0603]
R13  2k2 5% 1/10W  [R0603]
R14  3k9 1% 1/10W  [R0603]
U4  ATWINC15x0-MR210  [ATWINC15x0-MR210PB]
U5  XBEE PRO S2C MODULE  [XbeePRO]

### Ports
RC_ENTRADA (in), RC_OUT (out), WIFI_EN (in), WIFI_IRQN (out), WIFI_MISO (out), WIFI_MOSI (in), WIFI_RST (in), WIFI_SCK (in), WIFI_SS (in), WIFI_WAKE (in), XBEE_CTS (in), XBEE_DTR (in), XBEE_NRST (in), XBEE_RTS (out), XBEE_RX (in), XBEE_TX (out)

### Nets
3V3: R12.2
3V3_COM: C13.1 C14.1 C15.1 R4.2 R5.2 R10.1 U5.1(VCC)
3V3_WIFI: R6.1 R10.2 U4.20(VBATT) U4.23(VDDIO)
GND: C13.2 C14.2 C15.2 C16.2 C17.2 Q1.3(E) R7.1 R14.1 U4.9(GND_1) U4.12(GND_2) U4.28(GND_3) U4.29(GND_PAD) U5.10(GND)
RC_ENTRADA: R11.1 R13.2 ; port RC_ENTRADA
RC_OUT: Q1.2(C) R11.2 R12.1 ; port RC_OUT
WIFI_EN: U4.22(CHIP_EN) ; port WIFI_EN
WIFI_IRQN: R8.1 ; port WIFI_IRQN
WIFI_MISO: U4.17(SPI_TXD) ; port WIFI_MISO
WIFI_MOSI: U4.15(SPI_RXD) ; port WIFI_MOSI
WIFI_RST: U4.4(RESET_N) ; port WIFI_RST
WIFI_SCK: U4.18(SPI_SCK) ; port WIFI_SCK
WIFI_SS: U4.16(SPI_SSN) ; port WIFI_SS
WIFI_WAKE: U4.11(WAKE) ; port WIFI_WAKE
XBEE_CTS: U5.12(~{CTS}/IO) ; port XBEE_CTS
XBEE_DTR: U5.9(~{DTR}/IO) ; port XBEE_DTR
XBEE_NRST: R4.1 U5.5(~{RESET}) ; port XBEE_NRST
XBEE_RTS: U5.16(~{RTS}/IO) ; port XBEE_RTS
XBEE_RX: U5.3(RX/IO) ; port XBEE_RX
XBEE_TX: U5.2(TX/IO) ; port XBEE_TX
NetC16_1: C16.1 C17.1 U4.24(1P3V_TP)
NetQ1_1: Q1.1(B) R13.1 R14.2
NetR5_1: R5.1 R7.2 U5.14(VREF)
NetR6_2: R6.2 U4.10(SPI_CFG)
NetR8_2: R8.2 U4.13(IRQN)

Not connected (* = marked no-connect by the designer): U4 1(GPIO6) 2(I2C_SCL) 3(I2C_SDA) 5(NC)* 6(NC)* 7(NC)* 8(NC)* 14(UART_TXD) 19(UART_RXD)* 21(GPIO_1/RTC)* 25(GPIO_3) 26(GPIO_4) 27(GPIO_5); U5 4(IO0) 6(IO1) 7(IO2) 8(RESVD)* 11(IO4) 13(IO5) 15(IO6) 17(IO7) 18(IO8) 19(SCL/IO) 20(SDA/IO)

### Notes on the sheet
- XBEE Pro S2C (TH)
- WiFi
- Pegados al pin 1 (VCC)
- Recomendados por temas de ruido
- El SBUS viene invertido
- (near R11) Radiocontrol
- (near R12) No incluida

### Library data of the parts
C13 = Capacitor: as C18 on sheet MCU; Encapsulado: C0603; Valor: 1uF; Link: https://ar.mouser.com
C14 C16 = CapaPol: as C9 on sheet Alimentacion; Valor: 10uF; Link: https://ar.mouser.com/
C15 = Capacitor: Capacitor de placas paralelas; Proveedor: Elemon; Cod. Proveedor: CA3278332; Encapsulado: C0603; Link: http://www.elemon.net/
C17 = Capacitor: as C34 on sheet Sensores; Encapsulado: C0603; Valor: 10nF; Link: https://ar.mouser.com
Q1 = NPN: Transistor bipolar de juntura NPN; Proveedor: Elemon; Cod. Proveedor: TR1723043; Encapsulado: SOT23; Link: www.elemon.net
R4 = Resistor: as R20 on sheet MCU; Encapsulado: R0603; Valor: 100k; Link: https://ar.mouser.com
R5 R7 = Resistor: as R23 on sheet MCU; Encapsulado: R0603; Valor: 10k; Link: https://ar.mouser.com
R6 = Resistor: Resistencia; Cod. Proveedor: 603-RC0603FR-101ML; Proveedor: Mouser; Encapsulado: R0603; Valor: 1M; Link: https://ar.mouser.com
R8 R11 = Resistor: as R28 on sheet MCU; Encapsulado: R0603; Valor: 0E; Link: https://ar.mouser.com
R10 = Resistor: as R27 on sheet MCU; Valor: 0E; Link: https://ar.mouser.com
R12 = Resistor: as R15 on sheet MCU; Encapsulado: R0603; Valor: 1k; Link: https://ar.mouser.com
R13 = Resistor: as R36 on sheet Sensores; Encapsulado: R0603; Valor: 2k2; Link: https://ar.mouser.com
R14 = Resistor: as R37 on sheet Sensores; Encapsulado: R0603; Valor: 3k9; Link: https://ar.mouser.com
U4 = ATWINC15x0-MR210: IEEE 802.11 b/g/n SmartConnect  IoT Module; Proveedor: Mouser; Cod. Proveedor: 556-1500MR210PB1952; Encapsulado: ATWINC15x0-MR210PB; Link: https://ar.mouser.com/
U5 = XbeePRO_S2C: Conector modulo Zigbee Series 2 C; Proveedor: Mouser; Cod. Proveedor: 888-XBP24CAUIT-001; Encapsulado: Through Hole; Link: https://ar.mouser.com/

## Sheet ODROID.SchDoc
size A4
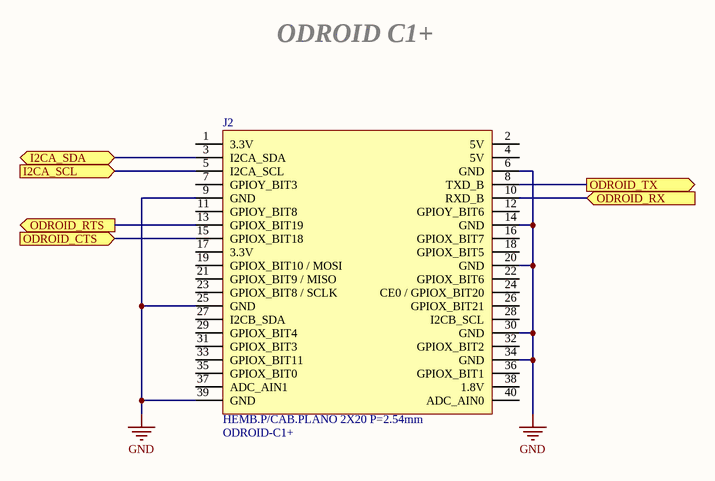
[diagram p5: ODROID.SchDoc]

### Parts
J2  HEMB.P/CAB.PLANO 2X20 P=2.54mm  [ODROID_C1+_MOUNTUP]

### Ports
I2CA_SCL (in), I2CA_SDA (bidir), ODROID_CTS (in), ODROID_RTS (out), ODROID_RX (in), ODROID_TX (out)

### Nets
GND: J2.6(GND) J2.9(GND) J2.14(GND) J2.20(GND) J2.25(GND) J2.30(GND) J2.34(GND) J2.39(GND)
I2C2_SCL: J2.5(I2CA_SCL) ; port I2CA_SCL
I2C2_SDA: J2.3(I2CA_SDA) ; port I2CA_SDA
ODROID_CTS: J2.15(GPIOX_BIT18) ; port ODROID_CTS
ODROID_RTS: J2.13(GPIOX_BIT19) ; port ODROID_RTS
ODROID_RX: J2.10(RXD_B) ; port ODROID_RX
ODROID_TX: J2.8(TXD_B) ; port ODROID_TX

Not connected (* = marked no-connect by the designer): J2 1(3.3V) 2(5V) 4(5V) 7(GPIOY_BIT3) 11(GPIOY_BIT8) 12(GPIOY_BIT6) 16(GPIOX_BIT7) 17(3.3V) 18(GPIOX_BIT5) 19(GPIOX_BIT10_/_MOSI) 21(GPIOX_BIT9_/_MISO) 22(GPIOX_BIT6) 23(GPIOX_BIT8_/_SCLK) 24(CE0_/_GPIOX_BIT20) 26(GPIOX_BIT21) 27(I2CB_SDA) 28(I2CB_SCL) 29(GPIOX_BIT4) 31(GPIOX_BIT3) 32(GPIOX_BIT2) 33(GPIOX_BIT11) 35(GPIOX_BIT0) 36(GPIOX_BIT1) 37(ADC_AIN1) 38(1.8V) 40(ADC_AIN0)

### Notes on the sheet
- ODROID C1+
- (in symbol Odroid_C1+) ODROID-C1+

### Library data of the parts
J2 = Odroid_C1+: Conector para odroid c1+; Cod. Proveedor: CO4751060; Proveedor: Elemon; Encapsulado: Through Hole; Link: http://www.elemon.net

## Sheet PCIe_104.SchDoc
size A4
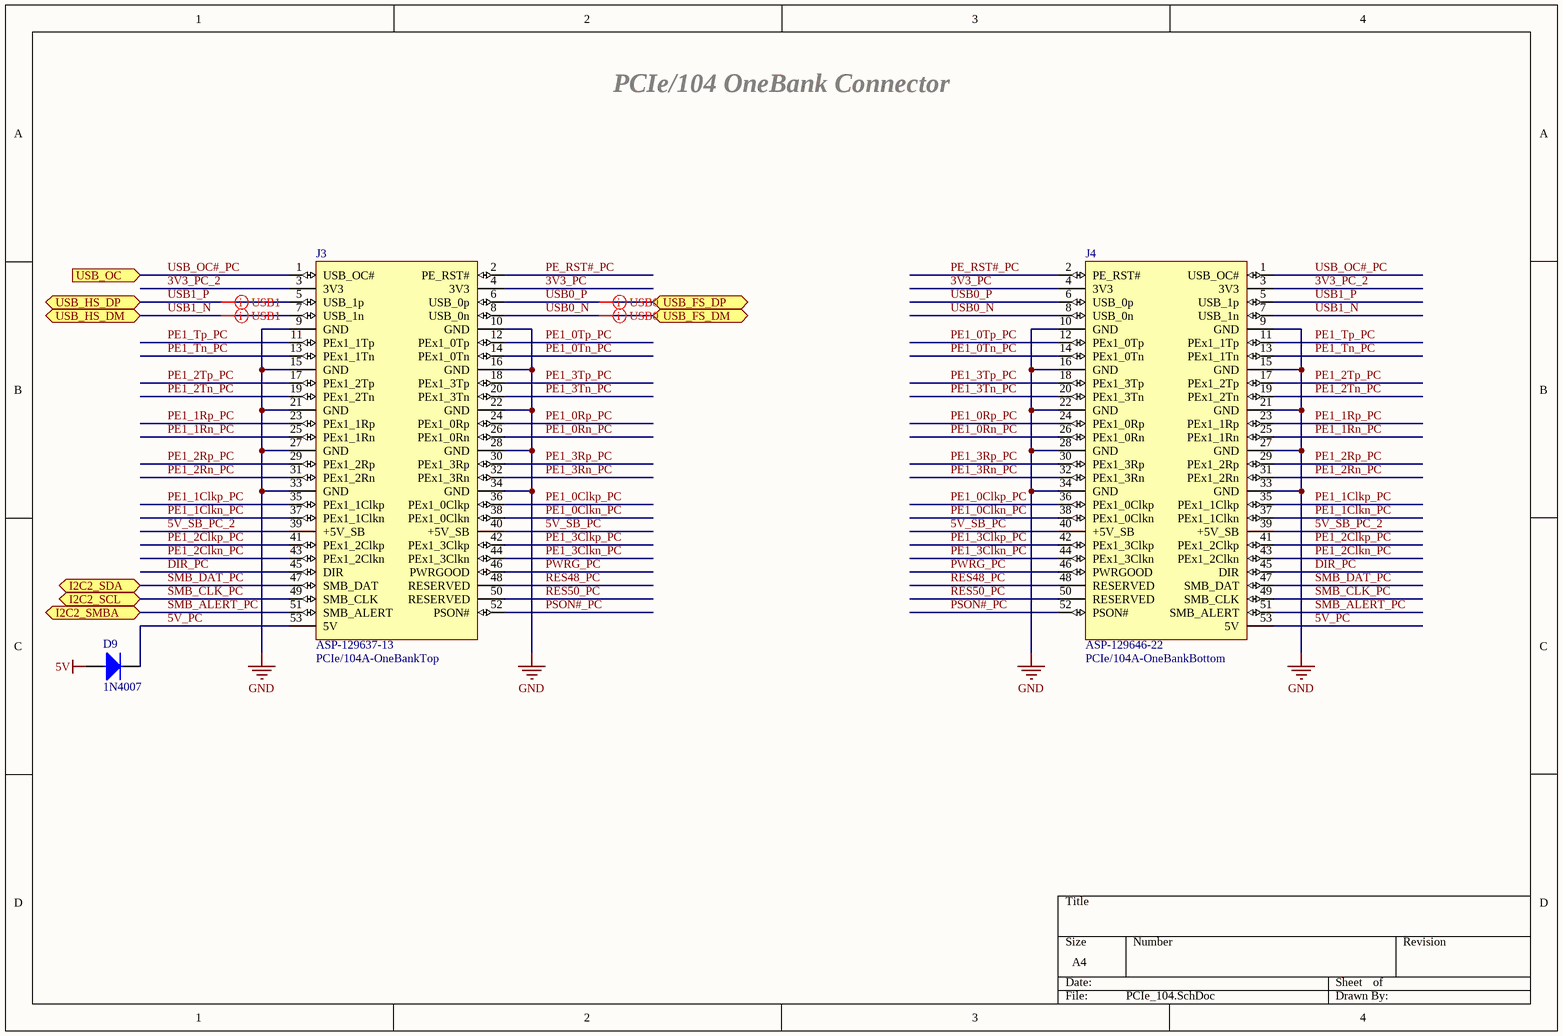
[diagram p6: PCIe_104.SchDoc]

### Parts
D9  1N4007  [SMA (DO-214AC)]
J3  ASP-129637-13  [ASP-129637-13]
J4  ASP-129646-22  [ASP-129646-22]

### Ports
I2C2_SCL (bidir), I2C2_SDA (bidir), I2C2_SMBA (bidir), USB_FS_DM (bidir), USB_FS_DP (bidir), USB_HS_DM (bidir), USB_HS_DP (bidir), USB_OC (in)

### Nets
5V: D9.1  [project net VOUT_SWTCH]
GND: J3.9(GND) J3.10(GND) J3.15(GND) J3.16(GND) J3.21(GND) J3.22(GND) J3.27(GND) J3.28(GND) J3.33(GND) J3.34(GND) J4.9(GND) J4.10(GND) J4.15(GND) J4.16(GND) J4.21(GND) J4.22(GND) J4.27(GND) J4.28(GND) J4.33(GND) J4.34(GND)
3V3_PC: J3.4(3V3) J4.4(3V3)
3V3_PC_2: J3.3(3V3) J4.3(3V3)
5V_PC: D9.2 J3.53(5V) J4.53(5V)
5V_SB_PC: J3.40(+5V_SB) J4.40(+5V_SB)
5V_SB_PC_2: J3.39(+5V_SB) J4.39(+5V_SB)
DIR_PC: J3.45(DIR) J4.45(DIR)
PE1_0Clkn_PC: J3.38(PEx1_0Clkn) J4.38(PEx1_0Clkn)
PE1_0Clkp_PC: J3.36(PEx1_0Clkp) J4.36(PEx1_0Clkp)
PE1_0Rn_PC: J3.26(PEx1_0Rn) J4.26(PEx1_0Rn)
PE1_0Rp_PC: J3.24(PEx1_0Rp) J4.24(PEx1_0Rp)
PE1_0Tn_PC: J3.14(PEx1_0Tn) J4.14(PEx1_0Tn)
PE1_0Tp_PC: J3.12(PEx1_0Tp) J4.12(PEx1_0Tp)
PE1_1Clkn_PC: J3.37(PEx1_1Clkn) J4.37(PEx1_1Clkn)
PE1_1Clkp_PC: J3.35(PEx1_1Clkp) J4.35(PEx1_1Clkp)
PE1_1Rn_PC: J3.25(PEx1_1Rn) J4.25(PEx1_1Rn)
PE1_1Rp_PC: J3.23(PEx1_1Rp) J4.23(PEx1_1Rp)
PE1_2Clkn_PC: J3.43(PEx1_2Clkn) J4.43(PEx1_2Clkn)
PE1_2Clkp_PC: J3.41(PEx1_2Clkp) J4.41(PEx1_2Clkp)
PE1_2Rn_PC: J3.31(PEx1_2Rn) J4.31(PEx1_2Rn)
PE1_2Rp_PC: J3.29(PEx1_2Rp) J4.29(PEx1_2Rp)
PE1_2Tn_PC: J3.19(PEx1_2Tn) J4.19(PEx1_2Tn)
PE1_2Tp_PC: J3.17(PEx1_2Tp) J4.17(PEx1_2Tp)
PE1_3Clkn_PC: J3.44(PEx1_3Clkn) J4.44(PEx1_3Clkn)
PE1_3Clkp_PC: J3.42(PEx1_3Clkp) J4.42(PEx1_3Clkp)
PE1_3Rn_PC: J3.32(PEx1_3Rn) J4.32(PEx1_3Rn)
PE1_3Rp_PC: J3.30(PEx1_3Rp) J4.30(PEx1_3Rp)
PE1_3Tn_PC: J3.20(PEx1_3Tn) J4.20(PEx1_3Tn)
PE1_3Tp_PC: J3.18(PEx1_3Tp) J4.18(PEx1_3Tp)
PE1_Tn_PC: J3.13(PEx1_1Tn) J4.13(PEx1_1Tn)
PE1_Tp_PC: J3.11(PEx1_1Tp) J4.11(PEx1_1Tp)
PE_RST#_PC: J3.2(PE_RST#) J4.2(PE_RST#)
PSON#_PC: J3.52(PSON#) J4.52(PSON#)
PWRG_PC: J3.46(PWRGOOD) J4.46(PWRGOOD)
RES48_PC: J3.48(RESERVED) J4.48(RESERVED)
RES50_PC: J3.50(RESERVED) J4.50(RESERVED)
SMB_ALERT_PC: J3.51(SMB_ALERT) J4.51(SMB_ALERT) ; port I2C2_SMBA  [project net I2C2_SMBA]
SMB_CLK_PC: J3.49(SMB_CLK) J4.49(SMB_CLK) ; port I2C2_SCL  [project net I2C2_SCL]
SMB_DAT_PC: J3.47(SMB_DAT) J4.47(SMB_DAT) ; port I2C2_SDA  [project net I2C2_SDA]
USB0_N: J3.8(USB_0n) J4.8(USB_0n) ; port USB_FS_DM
USB0_P: J3.6(USB_0p) J4.6(USB_0p) ; port USB_FS_DP
USB1_N: J3.7(USB_1n) J4.7(USB_1n) ; port USB_HS_DM
USB1_P: J3.5(USB_1p) J4.5(USB_1p) ; port USB_HS_DP
USB_OC#_PC: J3.1(USB_OC#) J4.1(USB_OC#) ; port USB_OC  [project net USB_OC]

### Layout directives
differential pair: USB0_N, USB0_P, USB1_N, USB1_P

### Notes on the sheet
- PCIe/104 OneBank Connector

### Library data of the parts
D9 = Diode: as D4 on sheet Sensores; Link: http://www.elemon.net/
J3 = PCIe/104A-OneBankTop: PCIe/104 Connector A, OneBank Top; Cod. Proveedor: SAM10885-ND; Proveedor: Digikey; Encapsulado: Surface Mount; Link: https://www.digikey.com/
J4 = PCIe/104A-OneBankBottom: PCIe/104 Connector A, OneBank Bottom; Cod. Proveedor: SAM10886-ND; Proveedor: Digikey; Encapsulado: Surface Mount; Link: https://www.digikey.com/

## Sheet Misc.SchDoc
size A4
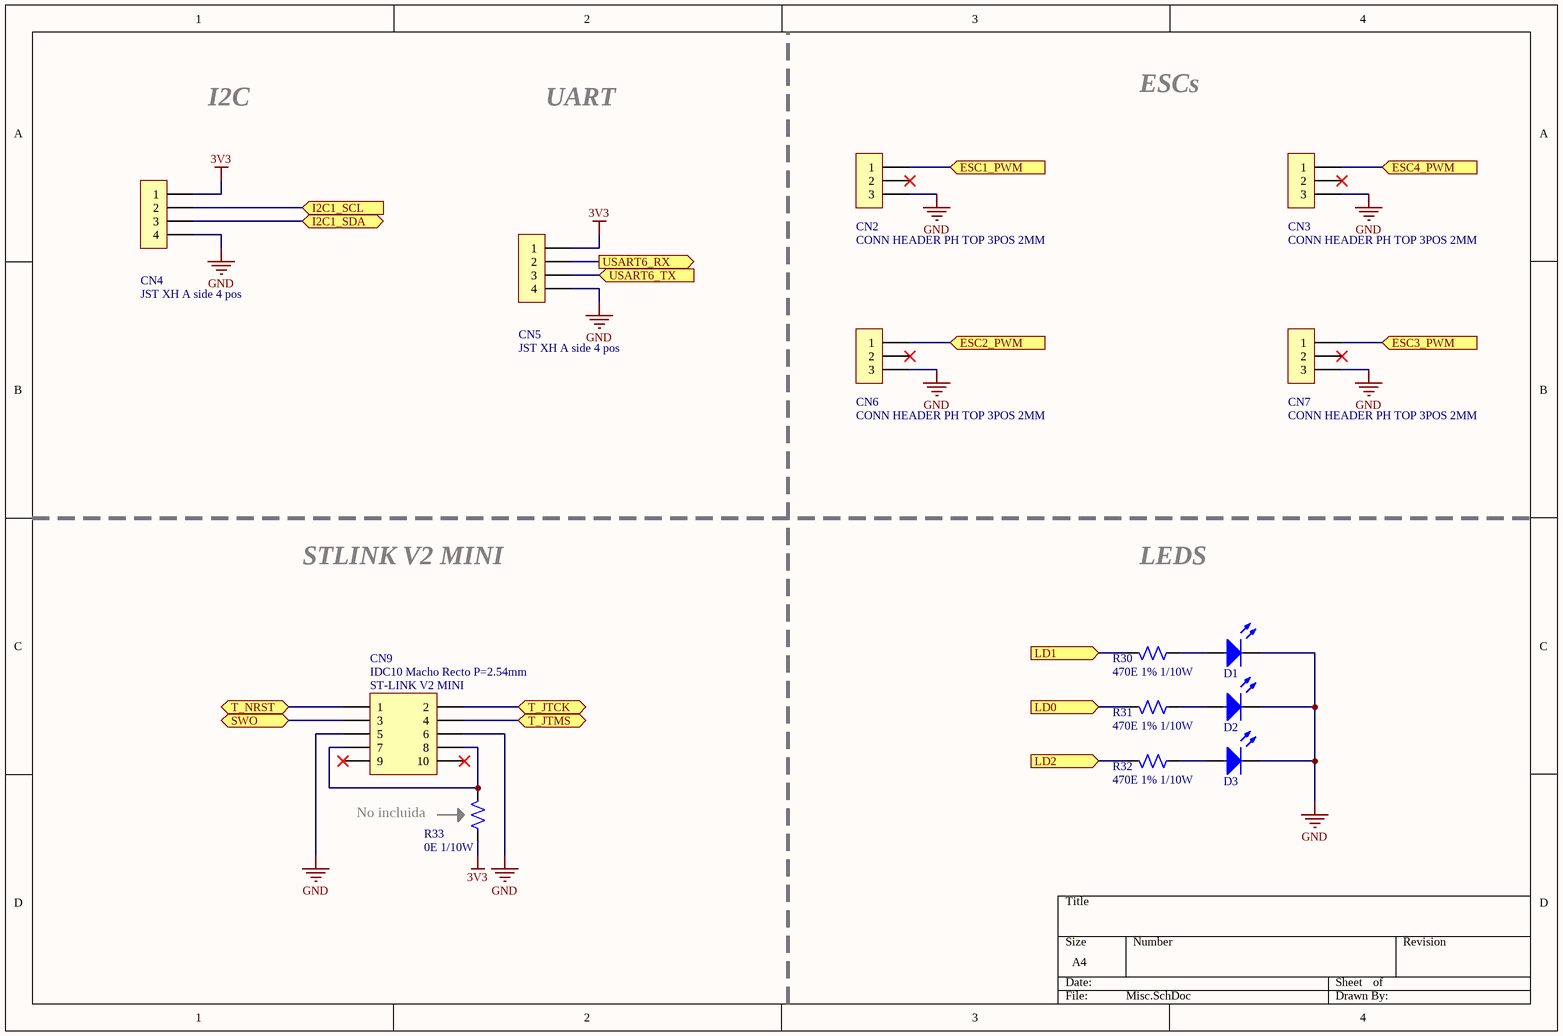
[diagram p7: Misc.SchDoc]

### Parts
CN2  CONN HEADER PH TOP 3POS 2MM  [JST-PH_3]
CN3  CONN HEADER PH TOP 3POS 2MM  [JST-PH_3]
CN4  JST XH A side 4 pos  [S4B-XH-A]
CN5  JST XH A side 4 pos  [S4B-XH-A]
CN6  CONN HEADER PH TOP 3POS 2MM  [JST-PH_3]
CN7  CONN HEADER PH TOP 3POS 2MM  [JST-PH_3]
CN9  IDC10 Macho Recto P=2.54mm  [IDC10M]
D1  Led  [LED_0805]  (value not drawn)
D2  Led  [LED_0805]  (value not drawn)
D3  Led  [LED_0805]  (value not drawn)
R30  470E 1% 1/10W  [R0603]
R31  470E 1% 1/10W  [R0603]
R32  470E 1% 1/10W  [R0603]
R33  0E 1/10W  [R0805]

### Ports
ESC1_PWM (in), ESC2_PWM (in), ESC3_PWM (in), ESC4_PWM (in), I2C1_SCL (in), I2C1_SDA (bidir), LD0 (in), LD1 (in), LD2 (in), SWO, T_JTCK, T_JTMS, T_NRST, USART6_RX (out), USART6_TX (in)

### Nets
3V3: CN4.1 CN5.1 R33.1
GND: CN2.3 CN3.3 CN4.4 CN5.4 CN6.3 CN7.3 CN9.5 CN9.6 D1.2 D2.2 D3.2
ESC1_PWM: CN2.1 ; port ESC1_PWM
ESC2_PWM: CN6.1 ; port ESC2_PWM
ESC3_PWM: CN7.1 ; port ESC3_PWM
ESC4_PWM: CN3.1 ; port ESC4_PWM
I2C1_SCL: CN4.2 ; port I2C1_SCL
I2C1_SDA: CN4.3 ; port I2C1_SDA
LD0: R31.2 ; port LD0
LD1: R30.2 ; port LD1
LD2: R32.2 ; port LD2
SWO: CN9.3 ; port SWO
T_JTCK: CN9.2 ; port T_JTCK
T_JTMS: CN9.4 ; port T_JTMS
T_NRST: CN9.1 ; port T_NRST
USART6_RX: CN5.2 ; port USART6_RX
USART6_TX: CN5.3 ; port USART6_TX
NetCN9_7: CN9.7 CN9.8 R33.2
NetD1_1: D1.1 R30.1
NetD2_1: D2.1 R31.1
NetD3_1: D3.1 R32.1

Not connected (* = marked no-connect by the designer): CN2 2*; CN3 2*; CN6 2*; CN7 2*; CN9 9* 10*

### Notes on the sheet
- I2C
- UART
- ESCs
- STLINK V2 MINI
- LEDS
- No incluida
- (in symbol Header_5x2H) ST-LINK V2 MINI

### Library data of the parts
CN2 CN3 CN6 CN7 = Header_3: Header, 3-pin; Cod. Proveedor: 455-1705-ND; Proveedor: Digikey; Encapsulado: Through Hole; Link: https://www.digikey.com
CN4 CN5 = Header_4: Header, 4-pin
CN9 = Header_5x2H: Header, 5x2-pin pinout horizontal; Proveedor: SDV Electronica; Encapsulado: Through Hole; Link: http://www.sdvelectronica.com.ar/conector-macho-recto-cable-plano-idc-10-pines-10-uni-139259442xJM
D1-D3 = Led: Diodo Led
R30-R32 = Resistor: as R25 on sheet MCU; Encapsulado: R0603; Valor: 470E; Link: https://ar.mouser.com
R33 = Resistor: as R27 on sheet MCU; Valor: 0E; Link: https://ar.mouser.com

## Nets that join several sheets
3V3: MCU (R27.1), Sensores (5 pins), Alimentacion (C12.1 U3.2 U3.4), Comunicaciones (R12.2), Misc (CN4.1 CN5.1 R33.1)
3V3_COM: Alimentacion (C10.1 U2.2 U2.4), Comunicaciones (7 pins)
GND: MCU (21 pins), Sensores (22 pins), Alimentacion (19 pins), Comunicaciones (13 pins), ODROID (8 pins), PCIe_104 (20 pins), Misc (11 pins)
VOUT_SWTCH: Sensores (6 pins), Alimentacion (10 pins), PCIe_104 (D9.1)
DCMI_D0: MCU (U6.68), Sensores (CN10.23)
DCMI_D1: MCU (U6.69), Sensores (CN10.22)
DCMI_D2: MCU (U6.65), Sensores (CN10.20)
DCMI_D3: MCU (U6.66), Sensores (CN10.19)
DCMI_D4: MCU (U6.3), Sensores (CN10.17)
DCMI_D5: MCU (U6.92), Sensores (CN10.16)
DCMI_D6: MCU (U6.4), Sensores (CN10.14)
DCMI_D7: MCU (U6.5), Sensores (CN10.13)
DCMI_HREF: MCU (U6.29), Sensores (CN10.8)
DCMI_PIXCK: MCU (U6.31), Sensores (CN10.10)
DCMI_VSYNC: MCU (U6.93), Sensores (CN10.7)
DCMI_XCLK: MCU (U6.67), Sensores (CN10.11)
ESC1_PWM: MCU (U6.40), Misc (CN2.1)
ESC2_PWM: MCU (U6.42), Misc (CN6.1)
ESC3_PWM: MCU (U6.44), Misc (CN7.1)
ESC4_PWM: MCU (U6.45), Misc (CN3.1)
GPS_RX: MCU (U6.23), Sensores (U9.2)
GPS_TX: MCU (U6.24), Sensores (U9.3)
I2C1_SCL: MCU (R16.2 U6.95), Sensores (CN10.4 U7.4 U8.23), Misc (CN4.2)
I2C1_SDA: MCU (R15.2 U6.96), Sensores (CN10.5 U7.3 U8.24), Misc (CN4.3)
I2C2_SCL: MCU (U6.47), ODROID (J2.5), PCIe_104 (J3.49 J4.49)
I2C2_SDA: MCU (U6.48), ODROID (J2.3), PCIe_104 (J3.47 J4.47)
I2C2_SMBA: MCU (U6.51), PCIe_104 (J3.51 J4.51)
IMU_AD0: MCU (U6.62), Sensores (U8.9)
IMU_FSYNC: MCU (U6.82), Sensores (U8.11)
IMU_INT: MCU (U6.81), Sensores (U8.12)
LD0: MCU (U6.32), Misc (R31.2)
LD1: MCU (U6.33), Misc (R30.2)
LD2: MCU (U6.34), Misc (R32.2)
ODROID_CTS: MCU (U6.59), ODROID (J2.15)
ODROID_RTS: MCU (U6.58), ODROID (J2.13)
ODROID_RX: MCU (U6.55), ODROID (J2.10)
ODROID_TX: MCU (U6.56), ODROID (J2.8)
RC_ENTRADA: Sensores (CN10.42), Comunicaciones (R11.1 R13.2)
RC_OUT: MCU (U6.80), Comunicaciones (Q1.2 R11.2 R12.1)
SWO: MCU (U6.89), Misc (CN9.3)
T_JTCK: MCU (U6.76), Misc (CN9.2)
T_JTMS: MCU (U6.72), Misc (CN9.4)
T_NRST: MCU (C25.1 R20.1 SW1.2 U6.14), Misc (CN9.1)
US1_TRIG: MCU (U6.38), Sensores (CN10.6)
US2_TRIG: MCU (U6.1), Sensores (CN10.18)
US3_TRIG: MCU (U6.41), Sensores (CN10.33)
US4_TRIG: MCU (U6.88), Sensores (CN10.32)
US5_TRIG: MCU (U6.2), Sensores (CN10.31)
US_ECHO: MCU (U6.90), Sensores (R36.1 R37.2)
USART6_RX: MCU (U6.64), Misc (CN5.2)
USART6_TX: MCU (U6.63), Misc (CN5.3)
USB0_N: MCU (R19.2), PCIe_104 (J3.8 J4.8)
USB0_P: MCU (R17.2), PCIe_104 (J3.6 J4.6)
USB1_N: MCU (R22.2), PCIe_104 (J3.7 J4.7)
USB1_P: MCU (R21.2), PCIe_104 (J3.5 J4.5)
USB_OC: MCU (U6.57), PCIe_104 (J3.1 J4.1)
WIFI_EN: MCU (U6.15), Comunicaciones (U4.22)
WIFI_IRQN: MCU (U6.18), Comunicaciones (R8.1)
WIFI_MISO: MCU (U6.79), Comunicaciones (U4.17)
WIFI_MOSI: MCU (U6.91), Comunicaciones (U4.15)
WIFI_RST: MCU (U6.16), Comunicaciones (U4.4)
WIFI_SCK: MCU (U6.78), Comunicaciones (U4.18)
WIFI_SS: MCU (U6.77), Comunicaciones (U4.16)
WIFI_WAKE: MCU (U6.17), Comunicaciones (U4.11)
XBEE_CTS: MCU (U6.85), Comunicaciones (U5.12)
XBEE_DTR: MCU (U6.61), Comunicaciones (U5.9)
XBEE_NRST: MCU (U6.83), Comunicaciones (R4.1 U5.5)
XBEE_RTS: MCU (U6.84), Comunicaciones (U5.16)
XBEE_RX: MCU (U6.86), Comunicaciones (U5.3)
XBEE_TX: MCU (U6.87), Comunicaciones (U5.2)